# Altium schematic sheet power.SchDoc
size A4; SheetNumber: 2; SheetTotal: 5
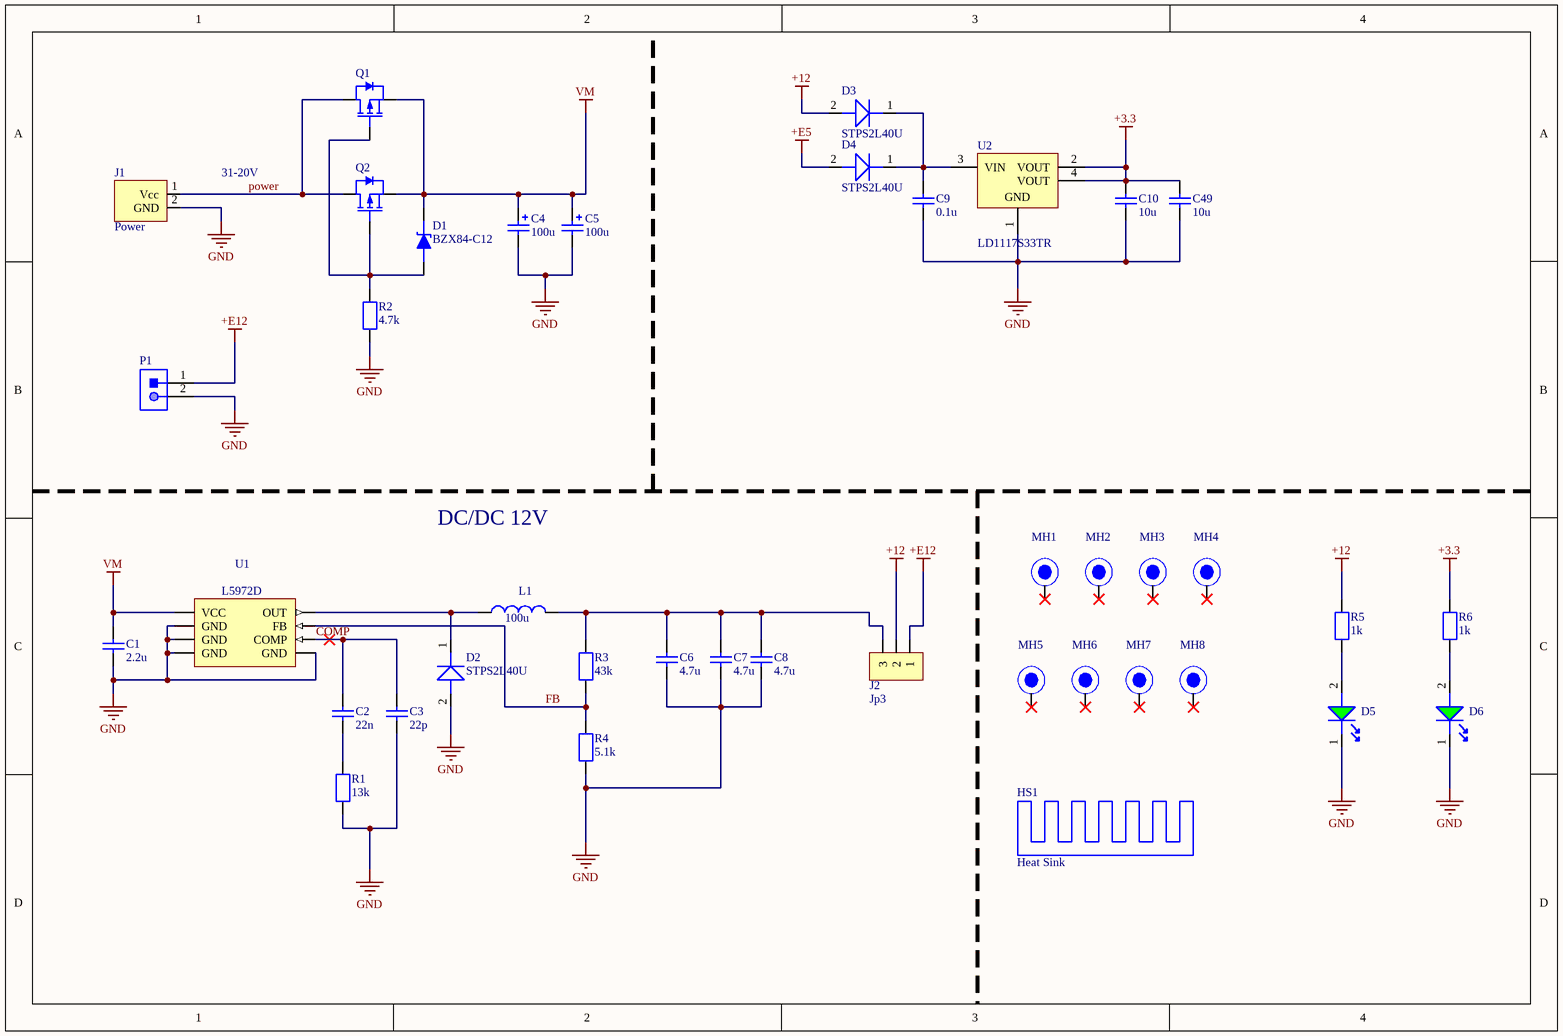
[diagram p0: power.SchDoc]

## Parts
C1  value 2.2u  [CAP_1206]  (hidden comment: CAP)
C2  value 22n  [CAPC2012X06N]  (hidden comment: CAP)
C3  value 22p  [CAPC2012X06N]  (hidden comment: CAP)
C4  value 100u  [B40940]  (hidden comment: Cap_Pos)
C5  value 100u  [B40940]  (hidden comment: Cap_Pos)
C6  value 4.7u  [CAP_1206]  (hidden comment: CAP)
C7  value 4.7u  [CAP_1206]  (hidden comment: CAP)
C8  value 4.7u  [CAP_1206]  (hidden comment: CAP)
C9  value 0.1u  [CAPC2012X06N]  (hidden comment: CAP)
C10  value 10u  [CAPC2012X06N]  (hidden comment: CAP)
C49  value 10u  [CAPC2012X06N]  (hidden comment: CAP)
D1  BZX84-C12  [SOT23]
D2  STPS2L40U  [CAPM3216X18N]
D3  STPS2L40U  [CAPM3216X18N]
D4  STPS2L40U  [CAPM3216X18N]
D5  GREEN  [DIOC3216X06N]  (value not drawn)
D6  GREEN  [DIOC3216X06N]  (value not drawn)
HS1  Heat Sink  [Heat Sink]
J1  Power  [Power Connector]
J2  Jp3  [HEADER 1x3 2.54mm]
L1  value 100u  [HE1040]  (hidden comment: HE1040)
MH1  MH  [MH]  (value not drawn)
MH2  MH  [MH]  (value not drawn)
MH3  MH  [MH]  (value not drawn)
MH4  MH  [MH]  (value not drawn)
MH5  MH  [MH]  (value not drawn)
MH6  MH  [MH]  (value not drawn)
MH7  MH  [MH]  (value not drawn)
MH8  MH  [MH]  (value not drawn)
P1  B2P-VH(LF)(SN)  [JST-B2P-VH(LF)(SN)_V]  (value not drawn)
Q1  IRF4905STRLPBF  [FP-PG-TO263-3-MFG]  (value not drawn)
Q2  IRF4905STRLPBF  [FP-PG-TO263-3-MFG]  (value not drawn)
R1  value 13k  [RESC2012X06N]  (hidden comment: Resistor)
R2  value 4.7k  [RESC2012X06N]  (hidden comment: Resistor)
R3  value 43k  [RESC2012X06N]  (hidden comment: Resistor)
R4  value 5.1k  [RESC2012X06N]  (hidden comment: Resistor)
R5  value 1k  [RESC2012X06N]  (hidden comment: Resistor)
R6  value 1k  [RESC2012X06N]  (hidden comment: Resistor)
U1  L5972D  [SO-8]
U2  LD1117S33TR  [STM-SOT-223_M]

## Nets
+3.3: C10.1 C49.1 R6.2 U2.2(VOUT) U2.4(VOUT)
+12: D3.2(A) J2.2 R5.2
+E5: D4.2(A)
+E12: J2.1 P1.1
GND: C1.2 C3.2 C4.2 C5.2 C6.2 C7.2 C8.2 C9.2 C10.2 C49.2 D2.2(A) D5.1 D6.1 J1.2(GND) P1.2 R1.1 R2.1 R4.1 U1.2(GND) U1.3(GND) U1.6(GND) U1.7(GND) U2.1(GND)
VM: C1.1 C4.1 C5.1 D1.3 Q1.S Q2.S U1.8(VCC)
COMP: C2.1 C3.1 U1.4(COMP)
FB: R3.1 R4.2 U1.5(FB)
power: J1.1(Vcc) Q1.D Q2.D
NetC2_2: C2.2 R1.2
NetC6_1: C6.1 C7.1 C8.1 J2.3 L1.2 R3.2
NetC9_1: C9.1 D3.1(K) D4.1(K) U2.3(VIN)
NetD1_1: D1.1 Q1.G Q2.G R2.2
NetD2_1: D2.1(K) L1.1 U1.1(OUT)
NetD5_2: D5.2 R5.1
NetD6_2: D6.2 R6.1

Not connected (* = marked no-connect by the designer): MH1 1*; MH2 1*; MH3 1*; MH4 1*; MH5 1*; MH6 1*; MH7 1*; MH8 1*

## Notes on the sheet
- 31-20V
- DC/DC 12V

## Library data of the parts
C1 = CAP: GRM21BR71E225K, Конденсатор керамический smd 2.2мкФ X7R 25В 0805; Source: *
C2 = CAP: GRM31MR72A223K, Конденсатор керамический smd 0.022мкФ 100В X7R, 10%; Source: *
C3 = CAP: GRM21A5C2E220J, Конденсатор керамический smd 22пФ C0G 250B 5% 0805; Source: *
C4 C5 = Cap_Pos: B40940A8107M000, 100 мкФ, 63 В,10х12.5, 20%
C6-C8 = CAP: GRM21BR61E475KA12L, Конденсатор керамический smd 4.7 мкФ X5R 10% 25В 0805; Source: *
C9 = CAP: Конденсатор керамический smd 0.01 мкФ NPO 50В 5%; Source: *
C10 C49 = CAP: Capacitor SMD 0805 X7R 10uФ 25В 10%; Source: *
D1 = BZX84-C12: BZX84-C12,215, Стабилитрон 12В, 5%
D2-D4 = DIOD: STPS2L40U, Диод Шоттки 40В 2А; Name: *
D5 D6 = LED_G: TO-3216BC-BF, Светодиод синий SMD 3216
HS1 = Heat Sink: HS 145-100, Радиатор 100х100х26 мм
J2 = Jumper3: PLS-3 (DS1021-1x3), Вилка штыревая 2.54мм 1x3pin
L1 = L: HE1040 101M2B 100мкГн ± 25%
P1 = CMP-002-00025-2: Male Header, Pitch 3.96 mm, 1 x 2 Position, Height 10.9 mm, Tail Length 3.7 mm, -25 to 85 degC, RoHS, Bulk; Manufacturer: JST; Case/Package: B2P-VH(LF)(SN); Connector Type: Header; Mounting Technology: TH; Package Reference: B2P-VH(LF)(SN); Package Description: Male Header, Pitch 3.96 mm, 1 x 2 Position, Height 10.9 mm, Tail Length 3.7 mm; Max Operating Temperature: 85°C; Manufacturer URL: http://www.jst.com/home2.html; RoHS Compliant: Unknown; Datasheet Version: May-16; Gender: Male; Min Operating Temperature: -25°C; Datasheet URL: http://www.jst-mfg.com/product/pdf/eng/eVH.pdf
Q1 Q2 = PMOS: IRF4905STRLPBF, Транзистор HEXFET, P-канал, 55В, 74А
R1 = Resistor: 0.125Вт 0805 13 кОм, 1%; Source: *
R2 = Resistor: 0.125Вт 0805 4.7 кОм, 1%; Source: *
R3 = Resistor: 0.125Вт 0805 43 кОм, 1%; Source: *
R4 = Resistor: 0.125Вт 0805 5.1 кОм, 1%; Source: *
R5 R6 = Resistor: 0.125Вт 0805 1 кОм, 1%; Source: *
U1 = L5972D: Buck Switching Regulator IC Positive Adjustable 1.235V 1 Output 2A 8-SOIC (0.154", 3.90mm Width)
U2 = CMP-019-00019-3: Low Drop Positive Voltage Regulator, 800 mA, Fixed 3.3 V Output, 0 to 125 degC, 3-Pin TO-220, RoHS, Tape and Reel; Manufacturer: STMicroelectronics; Max Supply Voltage: 15V; Dropout Voltage: 1.1V; Power: 12W; Output Current: 950mA; Min Input Voltage: 4.75V; Nominal Output Voltage: 3.3V; Max Ouput Current: 1.3A; Outputs: 1; Packaging: TapeandReel; Datasheet Version: Rev. 33, 11/2013; RoHS Compliant: True; Mounting Technology: SM; Max Input Voltage: 15V; Max Operating Temperature: 125°C; Package Reference: SOT-223; Package Quantity: 2500; Package Description: 4-Pin Small Outline Transistor, Body 6.5 x 3.5 mm, Pitch 2.3 mm; Case/Package: TO-261-4; Min Operating Temperature: 0°C; Datasheet URL: http://www.farnell.com/datasheets/1776449.pdf; Min Supply Voltage: 4.75V; Pins: 3; Output Voltage: 3.3V; Manufacturer URL: http://www.st.com/